# Altium schematic sheet [12] - DOC REVISION HISTORY.SchDoc
size A3; DocumentNumber: 12; SheetNumber: 12; SheetTotal: 13
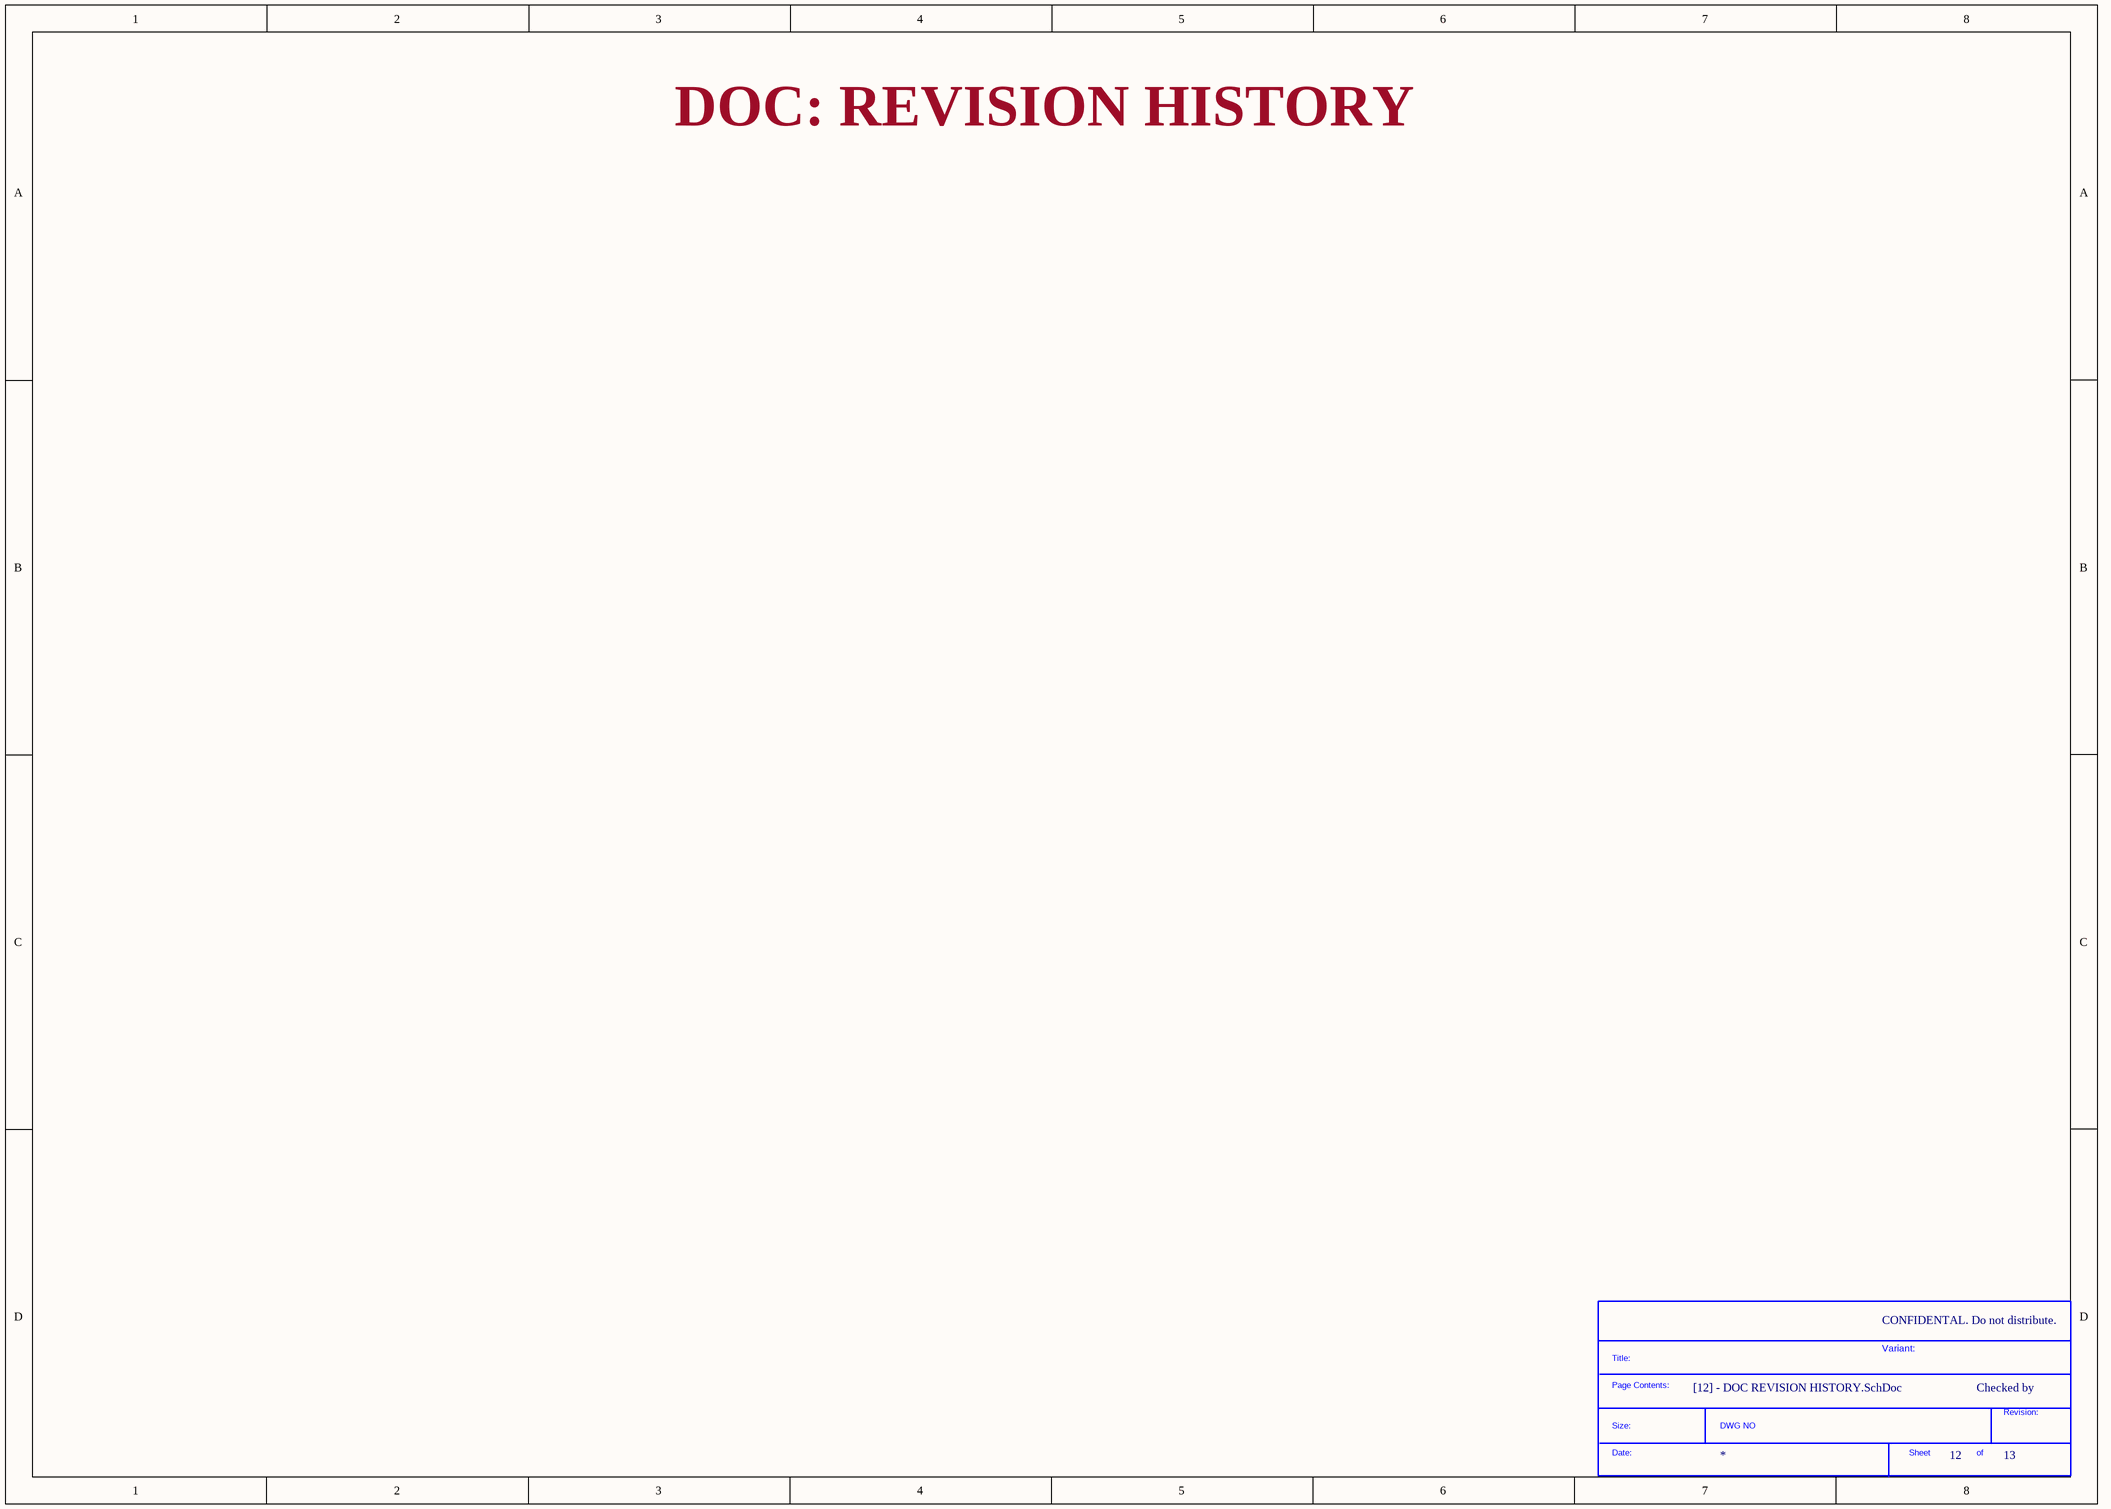
[diagram p0: [12] - DOC REVISION HISTORY.SchDoc]

## Parts
*  SDTitleBlock  (value not drawn)  (graphical)

## Notes on the sheet
- DOC: REVISION HISTORY
- CONFIDENTAL. Do not distribute.
- CLOCKS (CPU & PCIE)
- Variant:
- Checked by
- (in symbol SDTitleBlock) Title:; Page Contents:; Revision:; Size:; DWG NO; Date:; Sheet; of